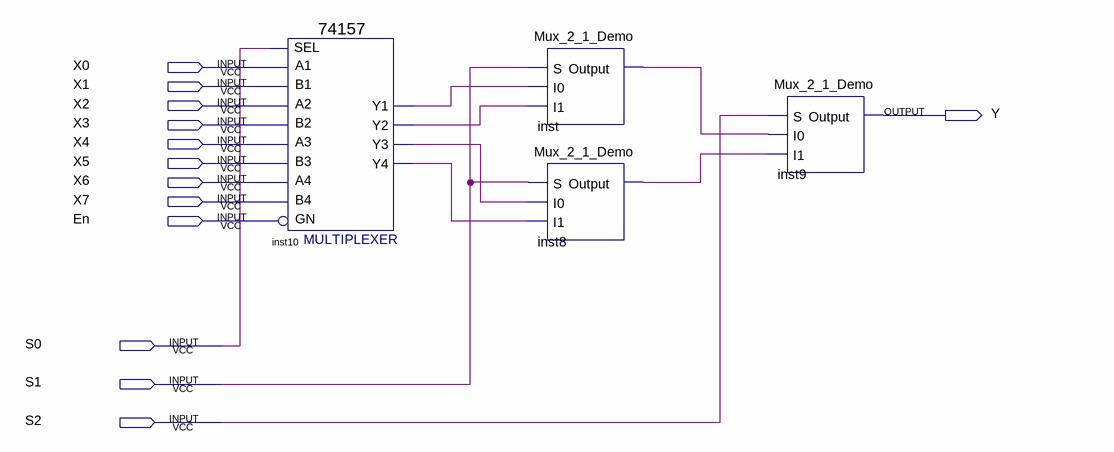
[diagram p0: schematic sheet]
// Quartus schematic Mux_8_1.bdf as structural Verilog: 4 symbols, 13 pins
module Mux_8_1 (
  input  X0,
  input  X1,
  input  X2,
  input  X3,
  input  X4,
  input  X5,
  input  X6,
  input  X7,
  input  En,
  input  S0,
  input  S1,
  input  S2,
  output Y
);

  wire inst8_output, inst10_y1, inst10_y2, inst10_y3, inst10_y4, inst_output;

  \74157  inst10 (
    .A1(X0), .B1(X1), .SEL(S0), .B2(X3), .A3(X4), .B3(X5), .A2(X2), .B4(X7), .GN(En), .A4(X6),
    .Y2(inst10_y2), .Y1(inst10_y1), .Y4(inst10_y4), .Y3(inst10_y3));
  Mux_2_1_Demo inst (.S(S1), .I0(inst10_y1), .I1(inst10_y2), .Output(inst_output));
  Mux_2_1_Demo inst8 (.S(S1), .I0(inst10_y3), .I1(inst10_y4), .Output(inst8_output));
  Mux_2_1_Demo inst9 (.S(S2), .I0(inst_output), .I1(inst8_output), .Output(Y));
endmodule
